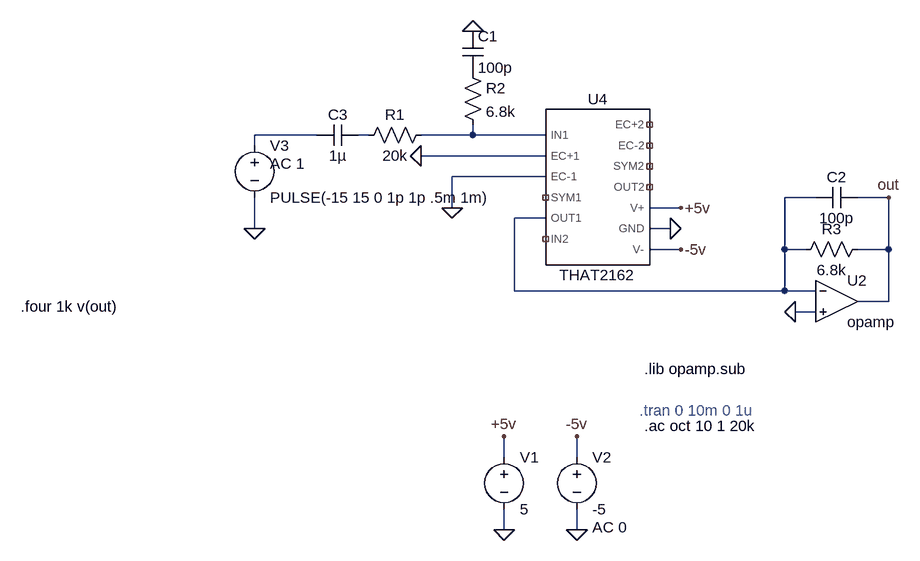
[diagram p0: schematic VCA.asc]
VCA.asc, the LTspice schematic file:
Version 4
SHEET 1 880 680
WIRE -144 -144 -240 -144
WIRE -64 -144 -80 -144
WIRE 96 -144 96 -160
WIRE 96 -144 16 -144
WIRE 208 -144 96 -144
WIRE -240 -128 -240 -144
WIRE 208 -112 16 -112
WIRE 208 -80 64 -80
WIRE 624 -48 576 -48
WIRE 736 -48 688 -48
WIRE 64 -32 64 -80
WIRE 416 -32 368 -32
WIRE 208 -16 160 -16
WIRE -240 0 -240 -48
WIRE 400 0 368 0
WIRE 416 32 368 32
WIRE 576 32 576 -48
WIRE 608 32 576 32
WIRE 736 32 736 -48
WIRE 736 32 688 32
WIRE 160 96 160 -16
WIRE 576 96 576 32
WIRE 576 96 160 96
WIRE 624 96 576 96
WIRE 736 112 736 32
WIRE 736 112 688 112
WIRE 624 128 592 128
WIRE 144 352 144 320
WIRE 256 352 256 320
WIRE 144 464 144 432
WIRE 256 464 256 432
FLAG 144 464 0
FLAG 256 464 0
FLAG 256 320 -5v
FLAG 400 0 0
FLAG 416 -32 +5v
FLAG 416 32 -5v
FLAG -240 0 0
FLAG 96 -304 0
FLAG 592 128 0
FLAG 736 -48 out
FLAG 16 -112 0
FLAG 144 320 +5v
FLAG 64 -32 0
SYMBOL voltage 144 336 R0
WINDOW 123 24 124 Left 2
WINDOW 39 0 0 Left 0
SYMATTR InstName V1
SYMATTR Value 5
SYMBOL voltage 256 336 R0
WINDOW 123 24 124 Left 2
WINDOW 39 0 0 Left 0
SYMATTR Value2 AC 0
SYMATTR InstName V2
SYMATTR Value -5
SYMBOL OpAmps\\opamp 656 48 R0
SYMATTR InstName U2
SYMBOL voltage -240 -144 R0
WINDOW 123 24 44 Left 2
WINDOW 39 0 0 Left 0
SYMATTR Value2 AC 1
SYMATTR InstName V3
SYMATTR Value PULSE(-15 15 0 1p 1p .5m 1m)
SYMBOL res 32 -160 R90
WINDOW 0 0 56 VBottom 2
WINDOW 3 32 56 VTop 2
SYMATTR InstName R1
SYMATTR Value 20k
SYMBOL res 80 -256 R0
SYMATTR InstName R2
SYMATTR Value 6.8k
SYMBOL cap 80 -304 R0
SYMATTR InstName C1
SYMATTR Value 100p
SYMBOL res 704 16 R90
WINDOW 0 0 56 VBottom 2
WINDOW 3 32 56 VTop 2
SYMATTR InstName R3
SYMATTR Value 6.8k
SYMBOL cap 688 -64 R90
WINDOW 0 0 32 VBottom 2
WINDOW 3 32 32 VTop 2
SYMATTR InstName C2
SYMATTR Value 100p
SYMBOL cap -80 -160 R90
WINDOW 0 0 32 VBottom 2
WINDOW 3 32 32 VTop 2
SYMATTR InstName C3
SYMATTR Value 1µ
SYMBOL THAT2162 288 -64 R0
SYMATTR InstName U4
TEXT 352 280 Left 2 ;.tran 0 10m 0 1u
TEXT 360 216 Left 2 !.lib opamp.sub
TEXT 360 304 Left 2 !.ac oct 10 1 20k
TEXT -600 120 Left 2 !.four 1k v(out)

The netlist it stands for:
* VCA.asc
V1 +5v 0 5
V2 -5v 0 -5 AC 0
XU2 N004 0 out opamp Aol=100K GBW=10Meg  ; pins invin noninvin out
V3 N001 0 PULSE(-15 15 0 1p 1p .5m 1m) AC 1
R1 N003 N002 20k
R2 P001 N003 6.8k
C1 0 P001 100p
R3 out N004 6.8k
C2 out N004 100p
C3 N002 N001 1µ
XU4 N003 0 0 NC_01 N004 NC_02 NC_03 NC_04 NC_05 NC_06 +5v 0 -5v THAT2162  ; pins IN1 EC+1 EC-1 SYM1 OUT1 IN2 EC+2 EC-2 SYM2 OUT2 V+ GND V-
* .tran 0 10m 0 1u
.lib opamp.sub
.ac oct 10 1 20k
.four 1k v(out)
.lib 2162_Macro_03.lib
.backanno
.end